# Altium schematic sheet NBIOT.SchDoc
size A4
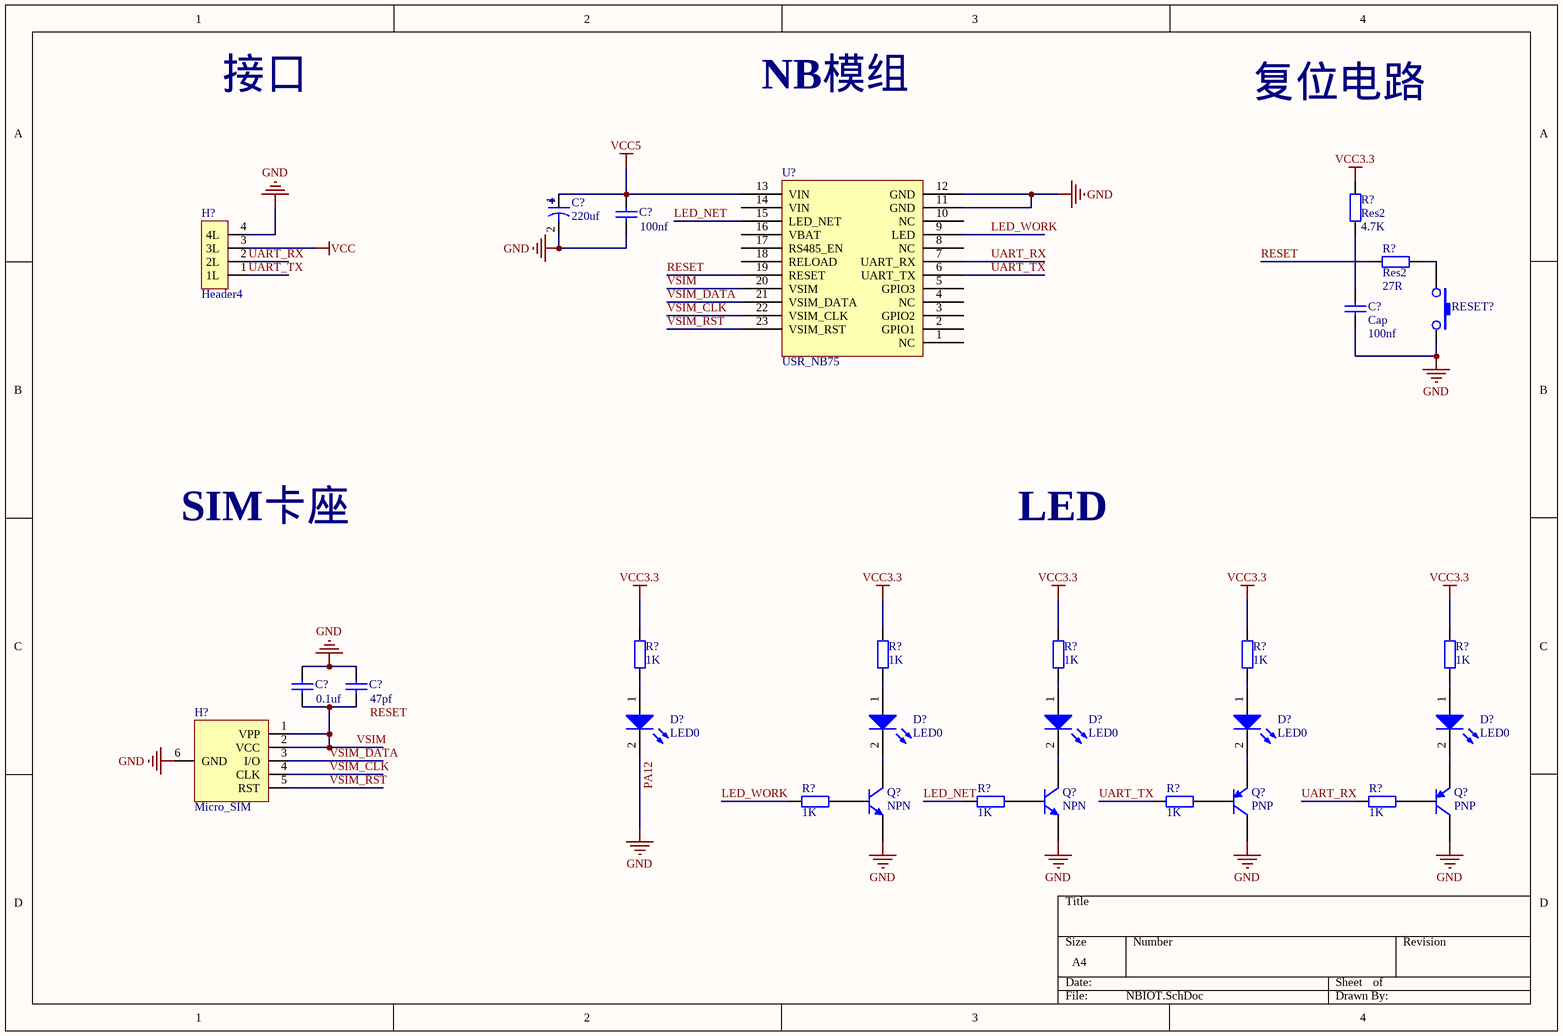
[diagram p0: NBIOT.SchDoc]

## Parts
(Parts that share a designator on the sheet are numbered #1, #2 ... from top to bottom, then left to right.)
C?#1  220uf  [HDR2.54-LI-2P]
C?#2  100nf  [0805C]
C?#3  Cap  value 100nf  [RAD-0.3]
C?#4  0.1uf  [0805C]
C?#5  47pf  [0805C]
D?#1  LED0  [LED_0805_B]
D?#2  LED0  [LED_0805_B]
D?#3  LED0  [LED_0805_B]
D?#4  LED0  [LED_0805_B]
D?#5  LED0  [LED_0805_B]
H?#1  Header4
H?#2  Micro_SIM
Q?#1  NPN  [TO-226-AA]
Q?#2  NPN  [TO-226-AA]
Q?#3  PNP  [SOT-23B_N]
Q?#4  PNP  [SOT-23B_N]
R?#1  Res2  value 4.7K  [AXIAL-0.4]
R?#2  Res2  value 27R  [AXIAL-0.4]
R?#3  1K  [0805R]
R?#4  1K  [0805R]
R?#5  1K  [0805R]
R?#6  1K  [0805R]
R?#7  1K  [0805R]
R?#8  1K  [0805R]
R?#9  1K  [0805R]
R?#10  1K  [0805R]
R?#11  1K  [0805R]
RESET?  RESET  [QKEY]  (value not drawn)
U?  USR_NB75

## Nets
PA12: C?#1.2 C?#2.1 C?#3.1 C?#4.2 C?#5.2 D?#1.2(K) H?#1.4(4L) H?#2.6(GND) Q?#1.3(E) Q?#2.3(E) Q?#3.1(C) Q?#4.1(C) RESET?.2 U?.11(GND) U?.12(GND)  [also labelled GND]
VCC: H?#1.3(3L)
VCC3.3: R?#1.2 R?#3.1 R?#4.1 R?#5.1 R?#6.1 R?#7.1
VCC5: C?#1.1 C?#2.2 U?.13(VIN)
LED_NET: R?#9.1 U?.15(LED_NET)
LED_WORK: R?#8.1 U?.9(LED)
RESET: R?#2.2 U?.19(RESET)
UART_RX: H?#1.2(2L) R?#11.1 U?.7(UART_RX)
UART_TX: H?#1.1(1L) R?#10.1 U?.6(UART_TX)
VSIM: C?#4.1 C?#5.1 H?#2.1(VPP) H?#2.2(VCC) U?.20(VSIM)
VSIM_CLK: H?#2.4(CLK) U?.22(VSIM_CLK)
VSIM_DATA: H?#2.3(I/O) U?.21(VSIM_DATA)
VSIM_RST: H?#2.5(RST) U?.23(VSIM_RST)
NetC?#3_2: C?#3.2 R?#1.1
NetD?#1_1: D?#1.1(A) R?#3.2
NetD?#2_1: D?#2.1(A) R?#4.2
NetD?#2_2: D?#2.2(K) Q?#1.1(C)
NetD?#3_1: D?#3.1(A) R?#5.2
NetD?#3_2: D?#3.2(K) Q?#2.1(C)
NetD?#4_1: D?#4.1(A) R?#6.2
NetD?#4_2: D?#4.2(K) Q?#3.3(E)
NetD?#5_1: D?#5.1(A) R?#7.2
NetD?#5_2: D?#5.2(K) Q?#4.3(E)
NetQ?#1_2: Q?#1.2(B) R?#8.2
NetQ?#2_2: Q?#2.2(B) R?#9.2
NetQ?#3_2: Q?#3.2(B) R?#10.2
NetQ?#4_2: Q?#4.2(B) R?#11.2
NetR?#2_1: R?#2.1 RESET?.1

Not connected (* = marked no-connect by the designer): U? 1(NC) 2(GPIO1) 3(GPIO2) 4(NC) 5(GPIO3) 8(NC) 10(NC) 14(VIN) 16(VBAT) 17(RS485_EN) 18(RELOAD)

## Notes on the sheet
- 接口
- NB模组
- 复位电路
- SIM卡座
- LED
- Labels drawn without touching a wire or pin: RESET

## Library data of the parts
C?#1 = Cap Pol3: Polarized Capacitor (Surface Mount); Published: 8-Jun-2000; LatestRevisionDate: 29-May-2009; LatestRevisionNote: IPC-7351 Footprint Added.; PackageReference: C0805; Publisher: Altium Limited; PackageDescription: Chip Capacitor; Value: 220uf
C?#2 C?#4 C?#5 = Cap: Capacitor; Value: 104; Published: 8-Jun-2000; LatestRevisionDate: 17-Jul-2002; LatestRevisionNote: Re-released for DXP Platform.; PackageReference: RAD-0.3; Publisher: Altium Limited; PackageDescription: Radial Cap, Thru-Hole; 2 Leads; 0.3 in Pin Spacing
C?#3 = Cap: Capacitor; Published: 8-Jun-2000; LatestRevisionDate: 17-Jul-2002; LatestRevisionNote: Re-released for DXP Platform.; PackageReference: RAD-0.3; Publisher: Altium Limited; PackageDescription: Radial Cap, Thru-Hole; 2 Leads; 0.3 in Pin Spacing
D?#1-D?#5 = LED0: Typical INFRARED GaAs LED; Published: 8-Jun-2000; LatestRevisionDate: 08-Jul-2005; LatestRevisionNote: Mech Layer 1 removed.; PackageReference: LED-0; Publisher: Altium Limited; PackageDescription: LED; 2 Leads
H?#1 = Header4: 4P接线
H?#2 = Micro_SIM: SD卡槽
Q?#1 Q?#2 = NPN: NPN Bipolar Transistor; Published: 8-Jun-2000; LatestRevisionDate: 17-Jul-2002; LatestRevisionNote: Re-released for DXP Platform.; PackageReference: TO-226-AA; Publisher: Altium Limited; PackageDescription: TO, Flat Index; 3 In-Line, Axial Leads; Body Dia. 4.8mm; Leads 0.55 x 0.51 mm (max); Code_JEDEC: TO-226-AA
Q?#3 Q?#4 = PNP: PNP Bipolar Transistor; Published: 8-Jun-2000; LatestRevisionDate: 29-May-2009; LatestRevisionNote: IPC-7351 Footprint Added.; PackageVersion: Aug-1999; PackageReference: SOT-23B; Publisher: Altium Limited; PackageDescription: 3-Pin SOT-23 Package 0.95 mm Pitch, 2.4 mm Lead Span
R?#1 R?#2 = Res2: Resistor; Published: 8-Jun-2000; LatestRevisionDate: 17-Jul-2002; LatestRevisionNote: Re-released for DXP Platform.; PackageReference: AXIAL-0.4; Publisher: Altium Limited; PackageDescription: Axial Device, Thru-Hole; 2 Leads; 0.4 in Pin Spacing
R?#3-R?#11 = Res2: Resistor; Manufacturer: Generic Components; Class: Passive; Value: 330; Published: 08/06/2000; Publisher: Altium Hobart Technology Centre; SubClass: Resistor
RESET? = SW-PB
U? = USR_NB75: NBIOT